# Altium schematic sheet Led.SchDoc
size A4; SheetNumber: 6; SheetTotal: 6
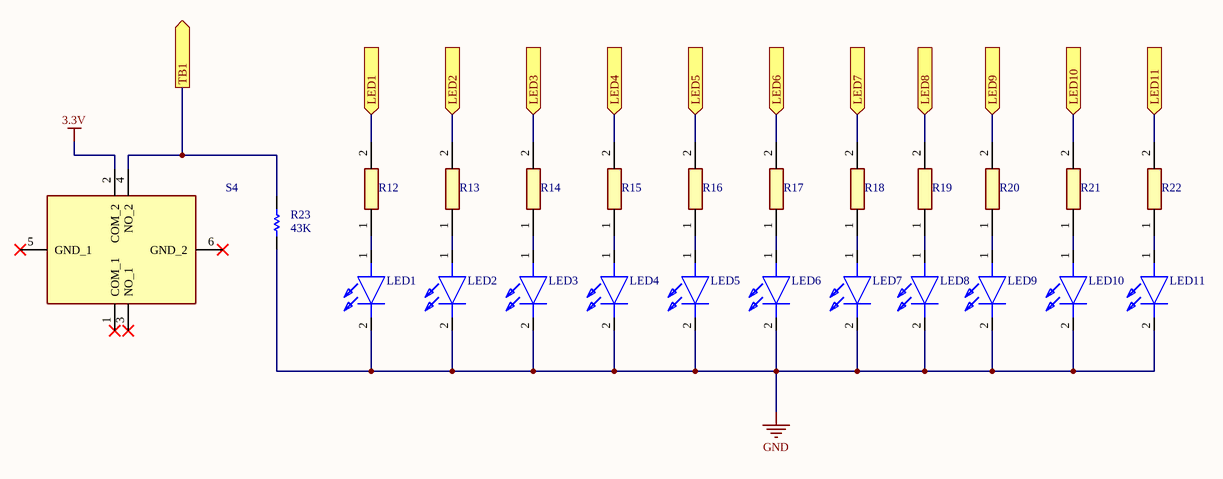
[diagram p0: Led.SchDoc]

## Parts
LED1  598-2105-107F  [5982105107F]  (value not drawn)
LED2  598-2105-107F  [5982105107F]  (value not drawn)
LED3  598-2105-107F  [5982105107F]  (value not drawn)
LED4  598-2105-107F  [5982105107F]  (value not drawn)
LED5  598-2105-107F  [5982105107F]  (value not drawn)
LED6  598-2105-107F  [5982105107F]  (value not drawn)
LED7  598-2105-107F  [5982105107F]  (value not drawn)
LED8  598-2105-107F  [5982105107F]  (value not drawn)
LED9  598-2105-107F  [5982105107F]  (value not drawn)
LED10  598-2105-107F  [5982105107F]  (value not drawn)
LED11  598-2105-107F  [5982105107F]  (value not drawn)
R12  ERJ-U06J102V  [ERJS06_U06_(0805)]  (value not drawn)
R13  ERJ-U06J102V  [ERJS06_U06_(0805)]  (value not drawn)
R14  ERJ-U06J102V  [ERJS06_U06_(0805)]  (value not drawn)
R15  ERJ-U06J102V  [ERJS06_U06_(0805)]  (value not drawn)
R16  ERJ-U06J102V  [ERJS06_U06_(0805)]  (value not drawn)
R17  ERJ-U06J102V  [ERJS06_U06_(0805)]  (value not drawn)
R18  ERJ-U06J102V  [ERJS06_U06_(0805)]  (value not drawn)
R19  ERJ-U06J102V  [ERJS06_U06_(0805)]  (value not drawn)
R20  ERJ-U06J102V  [ERJS06_U06_(0805)]  (value not drawn)
R21  ERJ-U06J102V  [ERJS06_U06_(0805)]  (value not drawn)
R22  ERJ-U06J102V  [ERJS06_U06_(0805)]  (value not drawn)
R23  value 43K  [RESC1608X55X30ML20T20]  (hidden comment: ERA3AEB433V)
S4  PTS526SMG20SMTR21_LFS  [PTS526SMG20SMTR21LFS]  (value not drawn)

## Ports
LED1 (in), LED2 (in), LED3 (in), LED4 (in), LED5 (in), LED6 (in), LED7 (in), LED8 (in), LED9 (in), LED10 (in), LED11 (in), TB1 (out)

## Nets
3.3V: S4.2(COM_2)
GND: LED1.2(K) LED2.2(K) LED3.2(K) LED4.2(K) LED5.2(K) LED6.2(K) LED7.2(K) LED8.2(K) LED9.2(K) LED10.2(K) LED11.2(K) R23.1
LED1: R12.2 ; port LED1
LED2: R13.2 ; port LED2
LED3: R14.2 ; port LED3
LED4: R15.2 ; port LED4
LED5: R16.2 ; port LED5
LED6: R17.2 ; port LED6
LED7: R18.2 ; port LED7
LED8: R19.2 ; port LED8
LED9: R20.2 ; port LED9
LED10: R21.2 ; port LED10
LED11: R22.2 ; port LED11
TB1: R23.2 S4.4(NO_2) ; port TB1
NetLED1_1: LED1.1(A) R12.1
NetLED2_1: LED2.1(A) R13.1
NetLED3_1: LED3.1(A) R14.1
NetLED4_1: LED4.1(A) R15.1
NetLED5_1: LED5.1(A) R16.1
NetLED6_1: LED6.1(A) R17.1
NetLED7_1: LED7.1(A) R18.1
NetLED8_1: LED8.1(A) R19.1
NetLED9_1: LED9.1(A) R20.1
NetLED10_1: LED10.1(A) R21.1
NetLED11_1: LED11.1(A) R22.1

Not connected (* = marked no-connect by the designer): S4 1(COM_1)* 3(NO_1)* 5(GND_1)* 6(GND_2)*

## Library data of the parts
LED1-LED11 = 598-2105-107F: LED; Manufacturer_Name: Dialight; Datasheet Link: https://s3-us-west-2.amazonaws.com/catsy.557/C18686.pdf; Height: 0.8128mm; Manufacturer_Part_Number: 598-2105-107F; Mouser Part Number: 645-598-2105-107F; Mouser Price/Stock: https://www.mouser.co.uk/ProductDetail/Dialight/598-2105-107F?qs=17ckDYBRdemC3ww5qaaOiA%3D%3D
R12-R22 = ERJ-U06J102V: Resistor; Manufacturer_Name: Panasonic; Datasheet Link: https://industrial.panasonic.com/cdbs/www-data/pdf/RDP0000/AOA0000C334.pdf; Height: 0.7mm; Manufacturer_Part_Number: ERJ-U06J102V; Mouser Part Number: 667-ERJ-U06J102V; Mouser Price/Stock: https://www.mouser.com/Search/Refine.aspx?Keyword=667-ERJ-U06J102V
R23 = CMP-2000-00064-1: Manufacturer: Panasonic; Part Number: ERA3AEB433V
S4 = PTS526SMG20SMTR21_LFS: Switch; Manufacturer_Name: C & K COMPONENTS; Manufacturer_Part_Number: PTS526SMG20SMTR21 LFS; Datasheet Link: https://www.ckswitches.com/media/2780/pts526.pdf; Height: 2.15mm; Mouser Part Number: 611-PTS526SMG20S21LF; Mouser Price/Stock: https://www.mouser.co.uk/ProductDetail/CK/PTS526SMG20SMTR21-LFS?qs=MyNHzdoqoQLOqPcVU%2F1RhA%3D%3D; Arrow Part Number: PTS526SMG20SMTR21 LFS; Arrow Price/Stock: https://www.arrow.com/en/products/pts526smg20smtr21-lfs/ck?region=nac